# Altium schematic sheet wifi.SchDoc
size B; SheetNumber: 3; SheetTotal: 9
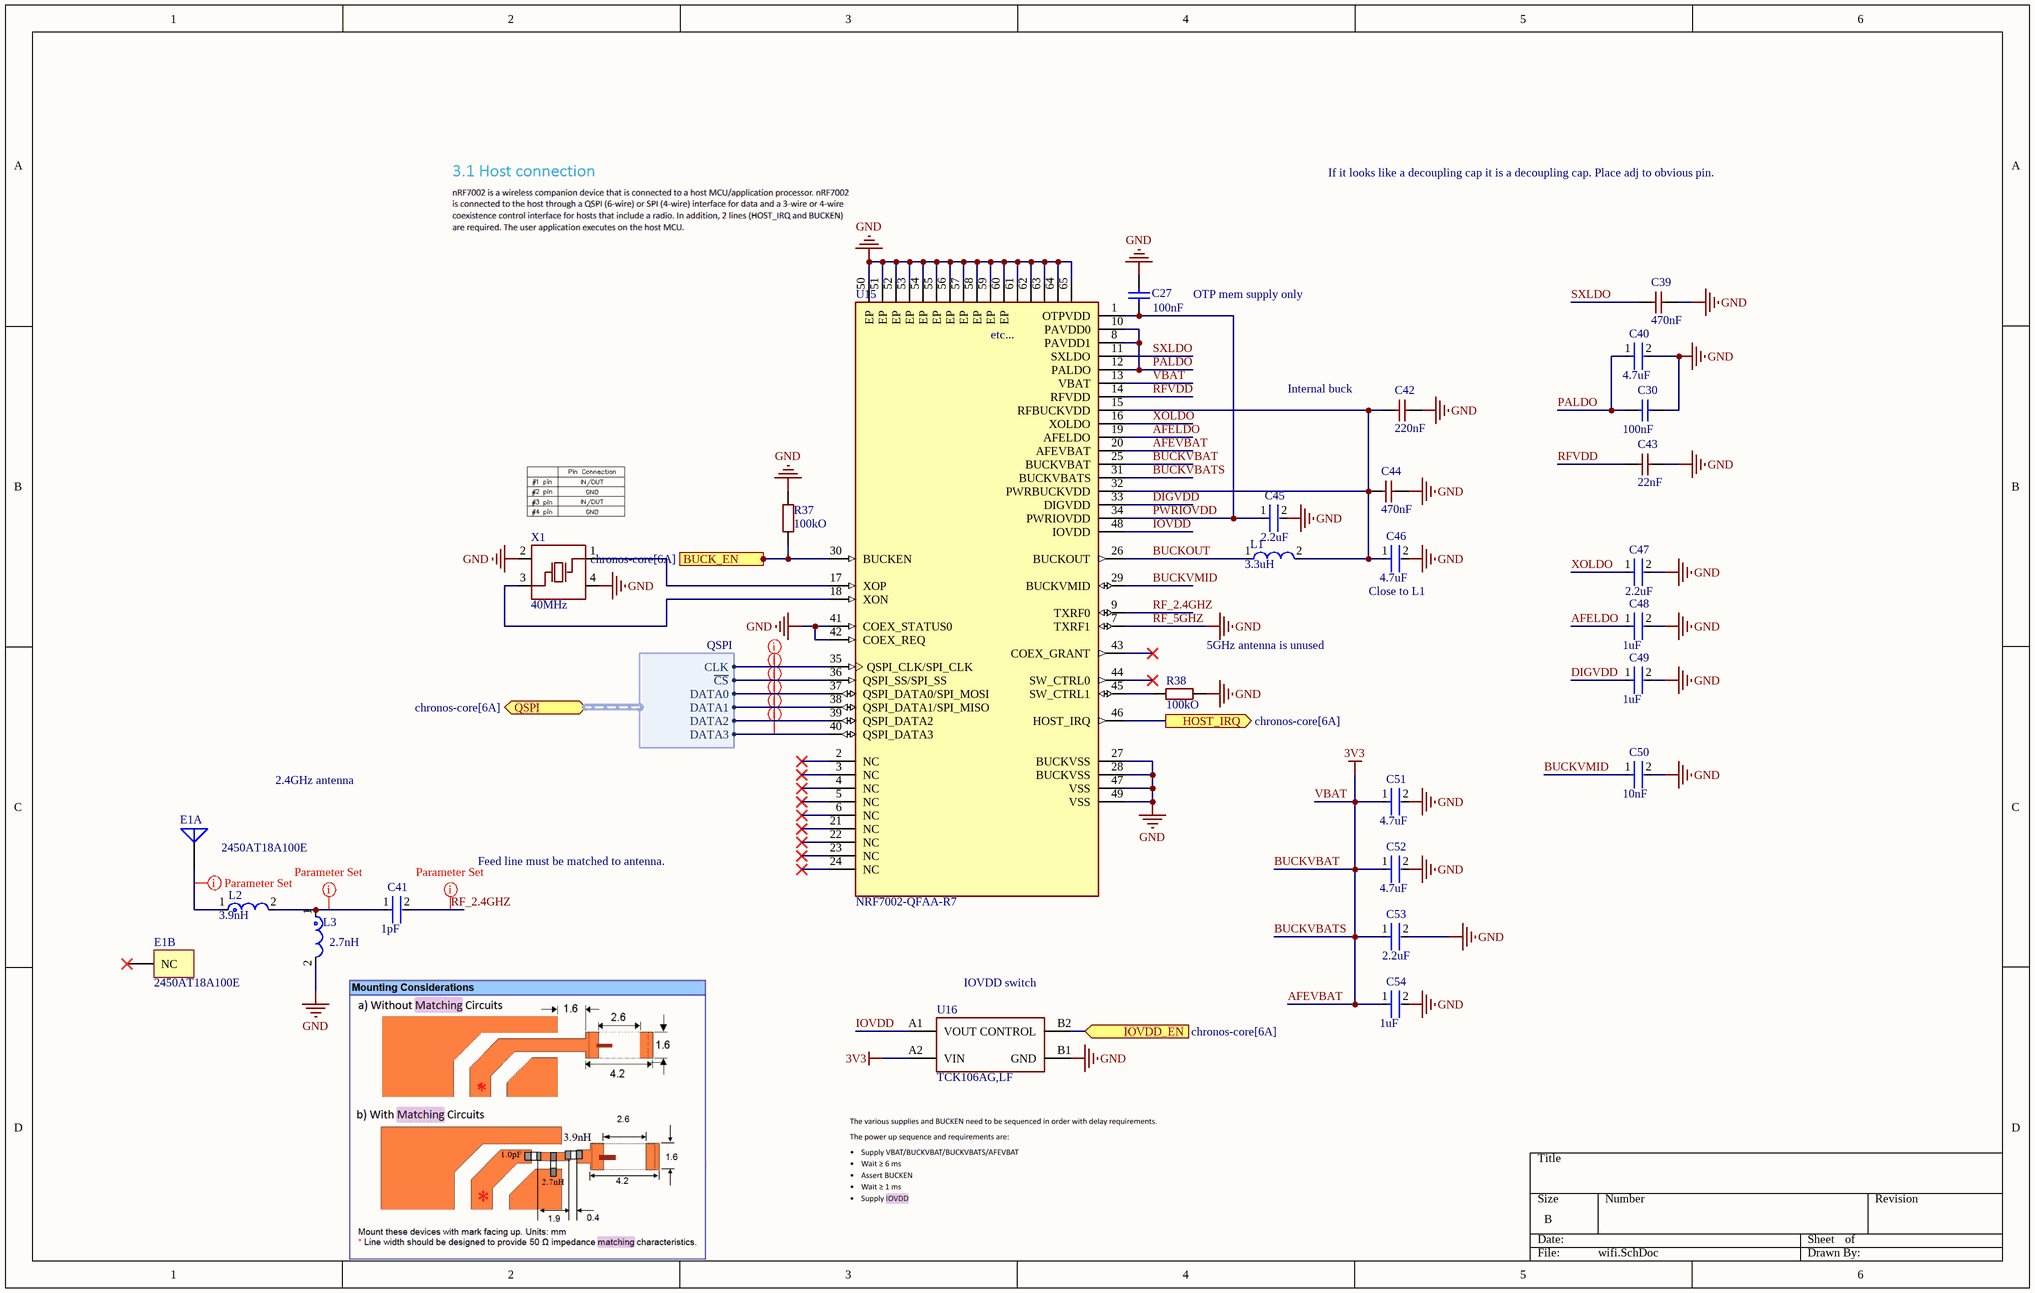
[diagram p0: wifi.SchDoc]

## Parts
C27  Capacitance: 100nF  [CAPC1050X55X23ML05T13]  (hidden comment: CL05B104KO5NNNC)
C30  Capacitance: 100nF  [CAPC1050X55X23ML05T13]  (hidden comment: CL05B104KO5NNNC)
C39  value 470nF  [CL10B474KA8NNNC]  (hidden comment: CL10B474KA8NNNC)
C40  Capacitance: 4.7uF  [FP-CL282-IPC_C]  (hidden comment: CL05A475MP5NRNC)
C41  Capacitance: 1pF  [FP-GJM155-0_05-IPC_B]  (hidden comment: GJM1555C1H1R0BB01D)
C42  value 220nF  [CL05B224KO5NNNC]  (hidden comment: CL05B224KO5NNNC)
C43  value 22nF  [0402B223K500NT]  (hidden comment: 0402B223K500NT)
C44  value 470nF  [CL10B474KA8NNNC]  (hidden comment: CL10B474KA8NNNC)
C45  Capacitance: 2.2uF  [FP-CL50-IPC_C]  (hidden comment: CL05A225MQ5NSNC)
C46  Capacitance: 4.7uF  [FP-CL282-IPC_C]  (hidden comment: CL05A475MP5NRNC)
C47  Capacitance: 2.2uF  [FP-CL50-IPC_C]  (hidden comment: CL05A225MQ5NSNC)
C48  Capacitance: 1uF  [FP-CL542-IPC_C]  (hidden comment: CL05A105KA5NQNC)
C49  Capacitance: 1uF  [FP-CL542-IPC_C]  (hidden comment: CL05A105KA5NQNC)
C50  Capacitance: 10nF  [FP-CL165-IPC_C]  (hidden comment: CL05B103KB5NNNC)
C51  Capacitance: 4.7uF  [FP-CL282-IPC_C]  (hidden comment: CL05A475MP5NRNC)
C52  Capacitance: 4.7uF  [FP-CL282-IPC_C]  (hidden comment: CL05A475MP5NRNC)
C53  Capacitance: 2.2uF  [FP-CL50-IPC_C]  (hidden comment: CL05A225MQ5NSNC)
C54  Capacitance: 1uF  [FP-CL542-IPC_C]  (hidden comment: CL05A105KA5NQNC)
E1  2450AT18A100E  [JT-2450AT18A100-2_V]  (parts A,B of 2)
L1  Inductance: 3.3uH  [FP-LQM2HPN_G0-IPC_B]  (hidden comment: LQM2HPN3R3MGCL)
L2  Inductance: 3.9nH  [FP-LQG15HH_02-IPC_A]  (hidden comment: LQG15HS3N9S02D)
L3  Inductance: 2.7nH  [FP-LQG15HH_02-IPC_C]  (hidden comment: LQG15HS2N7S02D)
R37  value 100kO  [0402WGF1003TCE]  (hidden comment: 0402WGF1003TCE)
R38  value 100kO  [0402WGF1003TCE]  (hidden comment: 0402WGF1003TCE)
U15  NRF7002-QFAA-R7  [IC_NRF7002-QFAA-R7]
U16  TCK106AG,LF  [TCK106AG,LF]
X1  value 40MHz  [TZ0308D]  (hidden comment: TZ0308D)

## Ports
BUCK_EN (in, see chronos-core[6A]), HOST_IRQ (out, see chronos-core[6A]), IOVDD_EN (in, see chronos-core[6A]), QSPI (bidir, harness QSPI, see chronos-core[6A])

## Harnesses
QSPI: CLK, ~{CS}, DATA0, DATA1, DATA2, DATA3

## Nets
AFEVBAT: C51.1 C52.1 C53.1 C54.1 U15.13(VBAT) U15.20(AFEVBAT) U15.25(BUCKVBAT) U15.31(BUCKVBATS) U16.A2(VIN)  [also labelled 3V3, BUCKVBAT, BUCKVBATS, VBAT]
RF_5GHZ: C27.2 C30.1 C39.2 C40.2 C42.2 C43.2 C44.2 C45.2 C46.2 C47.2 C48.2 C49.2 C50.2 C51.2 C52.2 C53.2 C54.2 L3.2 R37.2 R38.2 U15.7(TXRF1) U15.27(BUCKVSS) U15.28(BUCKVSS) U15.41(COEX_STATUS0) U15.42(COEX_REQ) U15.47(VSS) U15.49(VSS) U15.50(EP) U15.51(EP) U15.52(EP) U15.53(EP) U15.54(EP) U15.55(EP) U15.56(EP) U15.57(EP) U15.58(EP) U15.59(EP) U15.60(EP) U15.61(EP) U15.62(EP) U15.63(EP) U15.64(EP) U15.65(EP) U16.B1(GND) X1.2(GND) X1.4(GND)  [also labelled GND]
AFELDO: C48.1 U15.19(AFELDO)
BUCK_EN: R37.1 U15.30(BUCKEN) ; port BUCK_EN
BUCKOUT: L1.1 U15.26(BUCKOUT)
BUCKVMID: C50.1 U15.29(BUCKVMID)
DIGVDD: C49.1 U15.33(DIGVDD)
HOST_IRQ: U15.46(HOST_IRQ) ; port HOST_IRQ
IOVDD: U15.48(IOVDD) U16.A1(VOUT)
IOVDD_EN: U16.B2(CONTROL) ; port IOVDD_EN
PALDO: C30.2 C40.1 U15.8(PAVDD1) U15.10(PAVDD0) U15.12(PALDO)
PWRIOVDD: C27.1 C45.1 U15.1(OTPVDD) U15.34(PWRIOVDD)
RF_2.4GHZ: C41.2 U15.9(TXRF0)
RFVDD: C43.1 U15.14(RFVDD)
SXLDO: C39.1 U15.11(SXLDO)
XOLDO: C47.1 U15.16(XOLDO)
NetC41_1: C41.1 L2.2 L3.1
NetC42_1: C42.1 C44.1 C46.1 L1.2 U15.15(RFBUCKVDD) U15.32(PWRBUCKVDD)
NetE1_1: E1.1(FP) L2.1
NetR38_1: R38.1 U15.45(SW_CTRL1)
NetU15_17: U15.17(XOP) X1.1(OSC1)
NetU15_18: U15.18(XON) X1.3(OSC2)
NetU15_35: U15.35(QSPI_CLK/SPI_CLK) ; port QSPI.CLK
NetU15_36: U15.36(QSPI_SS/SPI_SS) ; port QSPI.~{CS}
NetU15_37: U15.37(QSPI_DATA0/SPI_MOSI) ; port QSPI.DATA0
NetU15_38: U15.38(QSPI_DATA1/SPI_MISO) ; port QSPI.DATA1
NetU15_39: U15.39(QSPI_DATA2) ; port QSPI.DATA2
NetU15_40: U15.40(QSPI_DATA3) ; port QSPI.DATA3

Not connected (* = marked no-connect by the designer): E1 2(NC)*; U15 2(NC)* 3(NC)* 4(NC)* 5(NC)* 6(NC)* 21(NC)* 22(NC)* 23(NC)* 24(NC)* 43(COEX_GRANT)* 44(SW_CTRL0)*

## Layout directives
net class WIFI_ANT: NetC41_1, NetE1_1, RF_2.4GHZ
net class WIFI_QSPI: NetU15_35, NetU15_36, NetU15_37, NetU15_38, NetU15_39, NetU15_40

## Notes on the sheet
- If it looks like a decoupling cap it is a decoupling cap. Place adj to obvious pin.
- OTP mem supply only
- (near C42) Internal buck
- (near C46) Close to L1
- (near R38) 5GHz antenna is unused
- 2.4GHz antenna
- Feed line must be matched to antenna.
- (near U16) IOVDD switch
- (in symbol NRF7002-QFAA-R7) etc...

## Library data of the parts
C27 C30 = CMP-2000-05439-1: Chip Capacitor, 100 nF, +/- 10%, 16 V, -55 to 125 degC, 0402 (1005 Metric), RoHS, Tape and Reel; Manufacturer: Samsung Electro-Mechanics; Dielectric: X7R; Rated Voltage: 16V; Case Size/Dimension: 0402; Tolerance (%): ±10%; Manufacturer URL: http://www.samsungsem.com/global/index.jsp; Datasheet URL: https://datasheet.ciiva.com/29198/458718-da-01-en-vs-kondensator-0402-29198423.pdf; Datasheet Version: Nov-10
C39 C44 = CL10B474KA8NNNC: Multilayer Ceramic Capacitors MLCC - SMD/SMT. 25V 470nF X7R +/-10% 0603 Multilayer Ceramic Capacitors MLCC - SMD/SMT ROHS; Manufacturer: Samsung Electro-Mechanics; Component Type: Capacitors; Design Item ID: CL10B474KA8NNNC; JLCPCB Part #: C1623; Manufacturer Part Number: CL10B474KA8NNNC
C40 C46 C51 C52 = CMP-13271-000548-1: Cap Ceramic 4.7uF 10V X5R ±20% SMD 0402 +85°C Paper T/R; Max Operating Temperature: 85°C; Lead Free: Lead Free; Tolerance: 20%; Voltage Rating: 10V; Dielectric: X5R; Width: 0.02inch; Length: 0.039inch; Case/Package: 0402; Min Operating Temperature: -55°C; Packaging: Tape and Reel; Thickness: 0.022inch; Case Code (Imperial): 0402; Package Quantity: 10000; Case Code (Metric): 1005; Mount: Surface Mount
C41 = CMP-2008-03808-2: Multi-Layer Ceramic Capacitor 1pF C0G  ±0.1pF 0402 Paper T/R; Temperature Coefficient: 30ppm/°C; Voltage Rating (DC): 50V; REACH SVHC: No SVHC; Packaging: Tape and Reel; Width: 0.02inch; Package Quantity: 10000; Min Operating Temperature: -55°C; Case Code (Imperial): 0402; Lead Pitch: 0.3mm; Length: 1mm; Max Operating Temperature: 125°C; Depth: 0.5mm; Thickness: 0.022inch; Case Code (Metric): 1005; Lead Free: Lead Free; Voltage: 50V; Mount: Surface Mount; Number of Pins: 2; Termination: SMD/SMT; Radiation Hardening: No; Dielectric: C0G; Case/Package: 0402; Voltage Rating: 50V; Height: 0.5mm
C42 = CL05B224KO5NNNC: Multilayer Ceramic Capacitors MLCC - SMD/SMT. 16V 220nF X7R +/-10% 0402 Multilayer Ceramic Capacitors MLCC - SMD/SMT ROHS; Manufacturer: Samsung Electro-Mechanics; Component Type: Capacitors; Design Item ID: CL05B224KO5NNNC; JLCPCB Part #: C16772; Manufacturer Part Number: CL05B224KO5NNNC
C43 = 0402B223K500NT: Multilayer Ceramic Capacitors MLCC - SMD/SMT. 22nF 50V X7R +/-10% 0402 Multilayer Ceramic Capacitors MLCC - SMD/SMT ROHS; Manufacturer: FH (Guangdong Fenghua Advanced Tech); Component Type: Capacitors; Design Item ID: 0402B223K500NT; JLCPCB Part #: C1532; Manufacturer Part Number: 0402B223K500NT
C45 C47 C53 = CMP-13271-001039-1: Cap Ceramic 2.2uF 6.3V X5R ±20% SMD 0402 +85°C Paper T/R; Length: 1mm; Height: 0.5mm; Tolerance: 20%; Case/Package: 0402; Width: 0.02inch; Mount: Surface Mount; Case Code (Imperial): 0402; Case Code (Metric): 1005; Depth: 0.5mm; Lead Free: Lead Free; Package Quantity: 10000; Min Operating Temperature: -55°C; Max Operating Temperature: 85°C; Dielectric: X5R; Voltage Rating: 6.3V; Thickness: 0.022inch; Radiation Hardening: No; Packaging: Tape and Reel
C48 C49 C54 = CMP-13271-001051-1: Cap Ceramic 1uF 25V X5R ±10% SMD 0402 +85°C Paper T/R; Radiation Hardening: No; Lead Free: Lead Free; Package Quantity: 10000; Max Operating Temperature: 85°C; Voltage Rating: 25V; Case/Package: 0402; Min Operating Temperature: -55°C; Packaging: Tape and Reel; Tolerance: 10%; Height: 0.5mm; Thickness: 0.022inch; Case Code (Metric): 1005; Width: 0.02inch; Case Code (Imperial): 0402; Dielectric: X5R; Length: 1mm; Mount: Surface Mount; Material: Ceramic; Depth: 0.5mm
C50 = CMP-13271-000387-1: Cap Ceramic 10nF 50V X7R ±10% SMD 0402 +125°C Paper T/R; Depth: 0.5mm; Length: 1mm; Lead Free: Lead Free; Case Code (Metric): 1005; Width: 0.02inch; Min Operating Temperature: -55°C; Thickness: 0.022inch; Package Quantity: 1; Mount: Surface Mount; Height: 0.5mm; Voltage: 50V; Material: Ceramic; Tolerance: 10%; Case Code (Imperial): 0402; Radiation Hardening: No; Case/Package: 0402; Max Operating Temperature: 125°C; Voltage Rating (DC): 50V; Contact Plating: Tin; Packaging: Tape and Reel; Voltage Rating: 50V; Dielectric: X7R
E1 = CMP-2000-05167-1: Ceramic Antenna, 2.45 GHZ, 2 W, -40 to 125 degC, 2-Pin SMD, RoHS, Tape and Reel; Manufacturer: Johanson Technology; Maximum Frequency: 2500MHz; Typical Antenna Gain: 0.5dB; Minimum Frequency: 2400MHz; Manufacturer URL: https://www.johansontechnology.com/; Type: Ceramic; Datasheet Version: Rev. 1.3, 07/2014; Category: Antenna; Package: 2Case18-4; Datasheet URL: http://www.johansontechnology.com/datasheets/antennas/2450AT18A100.pdf
L1 = CMP-06042-016451-1: Multilayer Type Inductor for Power Lines, 1008 (2520), 3.3μH, 20%, 0.2Ω, 1000mA; Max DC Current: 1A; Shielding: Shielded; Test Frequency: 1MHz; DC Resistance (DCR): 200mR; Self Resonant Frequency: 30MHz; Core Material: Ferrite; Case/Package: 1008; Height: 0.9mm; Series: LQM2HP_GC; Case Code (Metric): 2520; Package Quantity: 3000; Current Rating: 1A; Max Operating Temperature: 125°C; Lead Free: Lead Free; Width: 0.079inch; Min Operating Temperature: -55°C; Mount: Surface Mount; Tolerance: 20%; Height - Seated (Max): 0.039inch; Depth: 2.2mm; RoHS Compliant: Yes; Termination: SMD/SMT; Radiation Hardening: No; Length: 2.5mm; Case Code (Imperial): 1008; Packaging: Tape and Reel
L2 = CMP-06042-002811-1: Multilayer type RF Inductor 3.9nH ±0.3nH 0.14Ω 750mA 0402; Test Frequency: 100MHz; Self Resonant Frequency: 6GHz; DC Current: 300mA; Q Factor: 8; Shielding: Unshielded; DC Resistance (DCR): 180mR; Core Material: Air; Case Code (Imperial): 0402; Case/Package: 0402; Case Code (Metric): 1005; Height: 0.5mm; Mount: Surface Mount; Depth: 0.55mm; Packaging: Tape and Reel; Military Standard: Not; Length: 1mm; Max DC Current: 300mA; Max Operating Temperature: 125°C; Package Quantity: 10000; Lead Free: Lead Free; Termination: SMD/SMT; Height - Seated (Max): 0.022inch; Min Operating Temperature: -55°C; Radiation Hardening: No; Width: 0.02inch; Current Rating: 300mA
L3 = CMP-2000-06580-2: Multilayer type RF Inductor 2.7nH ±0.3nH 0.12Ω 800mA 0402; Max DC Current: 300mA; Q Factor: 8; Core Material: Air; Test Frequency: 100MHz; Shielding: Unshielded; Self Resonant Frequency: 6GHz; DC Resistance (DCR): 150mR; Packaging: Tape and Reel; Depth: 0.55mm; DC Current: 300mA; Length: 1mm; Current Rating: 300mA; Lead Free: Lead Free; Max Operating Temperature: 125°C; Mount: Surface Mount; Height - Seated (Max): 0.022inch; Case Code (Imperial): 0402; Height: 0.5mm; Termination: SMD/SMT; Package Quantity: 10000; Radiation Hardening: No; Width: 0.5mm; Case Code (Metric): 1005; Min Operating Temperature: -55°C; Military Standard: Not; Case/Package: 0402
R37 R38 = 0402WGF1003TCE: Resistors. -55C~+155C 100kohm 50V 62.5mW Thick Film Resistor +/-1% +/-100ppm/C 0402 Chip Resistor - Surface Mount ROHS; Manufacturer: UNI-ROYAL(Uniroyal Elec); Component Type: Resistors; Design Item ID: 0402WGF1003TCE; JLCPCB Part #: C25741; Manufacturer Part Number: 0402WGF1003TCE
U15 = NRF7002-QFAA-R7: IC RF TxRx Only WiFi 802.11a/b/g/-c/ax, Bluetooth, GPS 2.4GHz, 5GHz 48-VFQFN Exposed Pad; MF: Nordic Semiconductors; SnapEDA_Link: https://www.snapeda.com/parts/NRF7002-QFAA-R7/Nordic+Power/view-part/?ref=snap; Package: None; Value: *; MP: NRF7002-QFAA-R7; Check_prices: https://www.snapeda.com/parts/NRF7002-QFAA-R7/Nordic+Power/view-part/?ref=eda
U16 = TCK106AG,LF: Power Distribution Switches. -40C~+85C 1 1.1V~5.5V 1A 34mohm Active High Load Switch WCSPD-4(0.79x0.79) Power Distribution Switches ROHS; Manufacturer: TOSHIBA; Component Type: Integrated Circuits; Design Item ID: TCK106AG,LF; Value: TCK106AG,LF; JLCPCB Part #: C2149807; Manufacturer Part Number: TCK106AG,LF
X1 = TZ0308D: Crystals. -30C~+85C 30ohm 40MHz 9pF Crystal Oscillator +/-10ppm SMD3225-4P Crystals ROHS; Manufacturer: TST; Component Type: Crystal Oscillators; Design Item ID: TZ0308D; JLCPCB Part #: C379787; Manufacturer Part Number: TZ0308D